# Altium schematic sheet bus-main.SchDoc
size A4
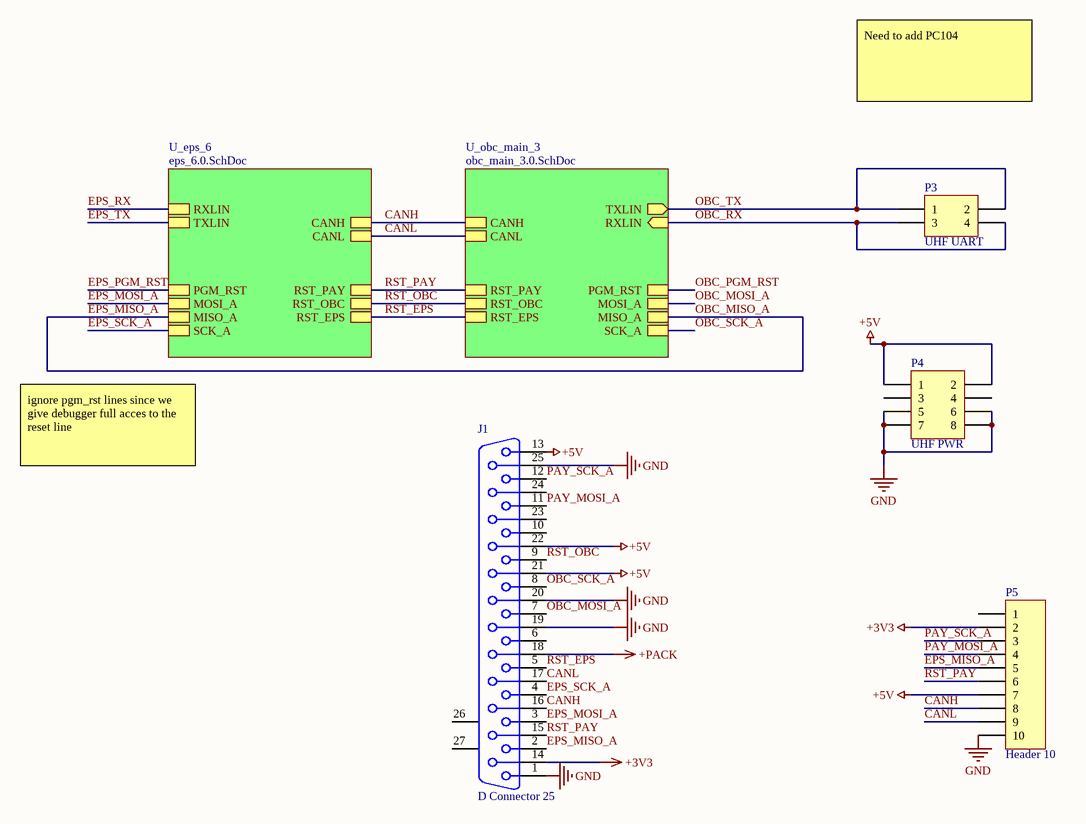
[diagram p0: bus-main.SchDoc]

## Parts
J1  D Connector 25  [Mini DSub Connector]
P3  UHF UART  [HDR2X2]
P4  UHF PWR  [HDR2X4]
P5  Header 10  [DF14-10P-1.25H(55) - duplicate]

## Sub-sheets
U_eps_6 = eps_6.0.SchDoc: RXLIN, TXLIN, RST_PAY, RST_OBC, RST_EPS, SCK_A, PGM_RST, MOSI_A, MISO_A, CANL, CANH
U_obc_main_3 = obc_main_3.0.SchDoc: RST_OBC, RST_EPS, CANL, RST_PAY, CANH, TXLIN (out), RXLIN (in), PGM_RST, MOSI_A, MISO_A, SCK_A

## Nets
+3V3: J1.14 P5.2
+5V: J1.13 J1.21 J1.22 P4.1 P4.2 P5.7
+PACK: J1.18
GND: J1.1 J1.19 J1.20 J1.25 P4.5 P4.6 P4.7 P4.8 P5.10
CANH: J1.16 P5.8 ; sheet U_obc_main_3/CANH, sheet U_eps_6/CANH
CANL: J1.17 P5.9 ; sheet U_obc_main_3/CANL, sheet U_eps_6/CANL
EPS_MISO_A: J1.2 P5.5 ; sheet U_obc_main_3/MISO_A, sheet U_eps_6/MISO_A  [also labelled OBC_MISO_A]
EPS_MOSI_A: J1.3 ; sheet U_eps_6/MOSI_A
EPS_PGM_RST: sheet U_eps_6/PGM_RST
EPS_RX: sheet U_eps_6/RXLIN
EPS_SCK_A: J1.4 ; sheet U_eps_6/SCK_A
EPS_TX: sheet U_eps_6/TXLIN
OBC_MOSI_A: J1.7 ; sheet U_obc_main_3/MOSI_A
OBC_PGM_RST: sheet U_obc_main_3/PGM_RST
OBC_RX: P3.3 P3.4 ; sheet U_obc_main_3/RXLIN
OBC_SCK_A: J1.8 ; sheet U_obc_main_3/SCK_A
OBC_TX: P3.1 P3.2 ; sheet U_obc_main_3/TXLIN
PAY_MOSI_A: J1.11 P5.4
PAY_SCK_A: J1.12 P5.3
RST_EPS: J1.5 ; sheet U_obc_main_3/RST_EPS, sheet U_eps_6/RST_EPS
RST_OBC: J1.9 ; sheet U_obc_main_3/RST_OBC, sheet U_eps_6/RST_OBC
RST_PAY: J1.15 P5.6 ; sheet U_obc_main_3/RST_PAY, sheet U_eps_6/RST_PAY

Not connected (* = marked no-connect by the designer): J1 6 10 23 24 26(MH1) 27(MH2); P4 3 4; P5 1

## Notes on the sheet
- Need to add PC104
- ignore pgm_rst lines since we give debugger full acces to the reset line

## Library data of the parts
J1 = D Connector 25: Receptacle Assembly, 25 Position, Right Angle; PackageDocument: U; Positions: 25; Published: 15-Jun-2001; LatestRevisionDate: 17-Jul-2002; LatestRevisionNote: Re-released for DXP Platform.; DatasheetDocument: 19-Mar-1999; PackageReference: 787202; Publisher: Altium Limited; Orientation: Right Angle; Gender: Receptacle; ComponentLink1Description: Mini-D25 - Molex, LLC 0836149012; ComponentLink1URL: https://www.digikey.ca/product-detail/en/molex-llc/0836149012/WM2144-ND/1867000
P3 = Header 2X2: Header, 2-Pin, Dual row; LatestRevisionDate: 17-Jul-2002; LatestRevisionNote: Re-released for DXP Platform.; Publisher: Altium Limited
P4 = Header 4X2: Header, 4-Pin, Dual row; LatestRevisionDate: 17-Jul-2002; LatestRevisionNote: Re-released for DXP Platform.; Publisher: Altium Limited
P5 = Header 10: Header, 10-Pin; LatestRevisionDate: 17-Jul-2002; LatestRevisionNote: Re-released for DXP Platform.; Publisher: Altium Limited